# EAGLE design detectino-raspi (EAGLE 7.2.0)
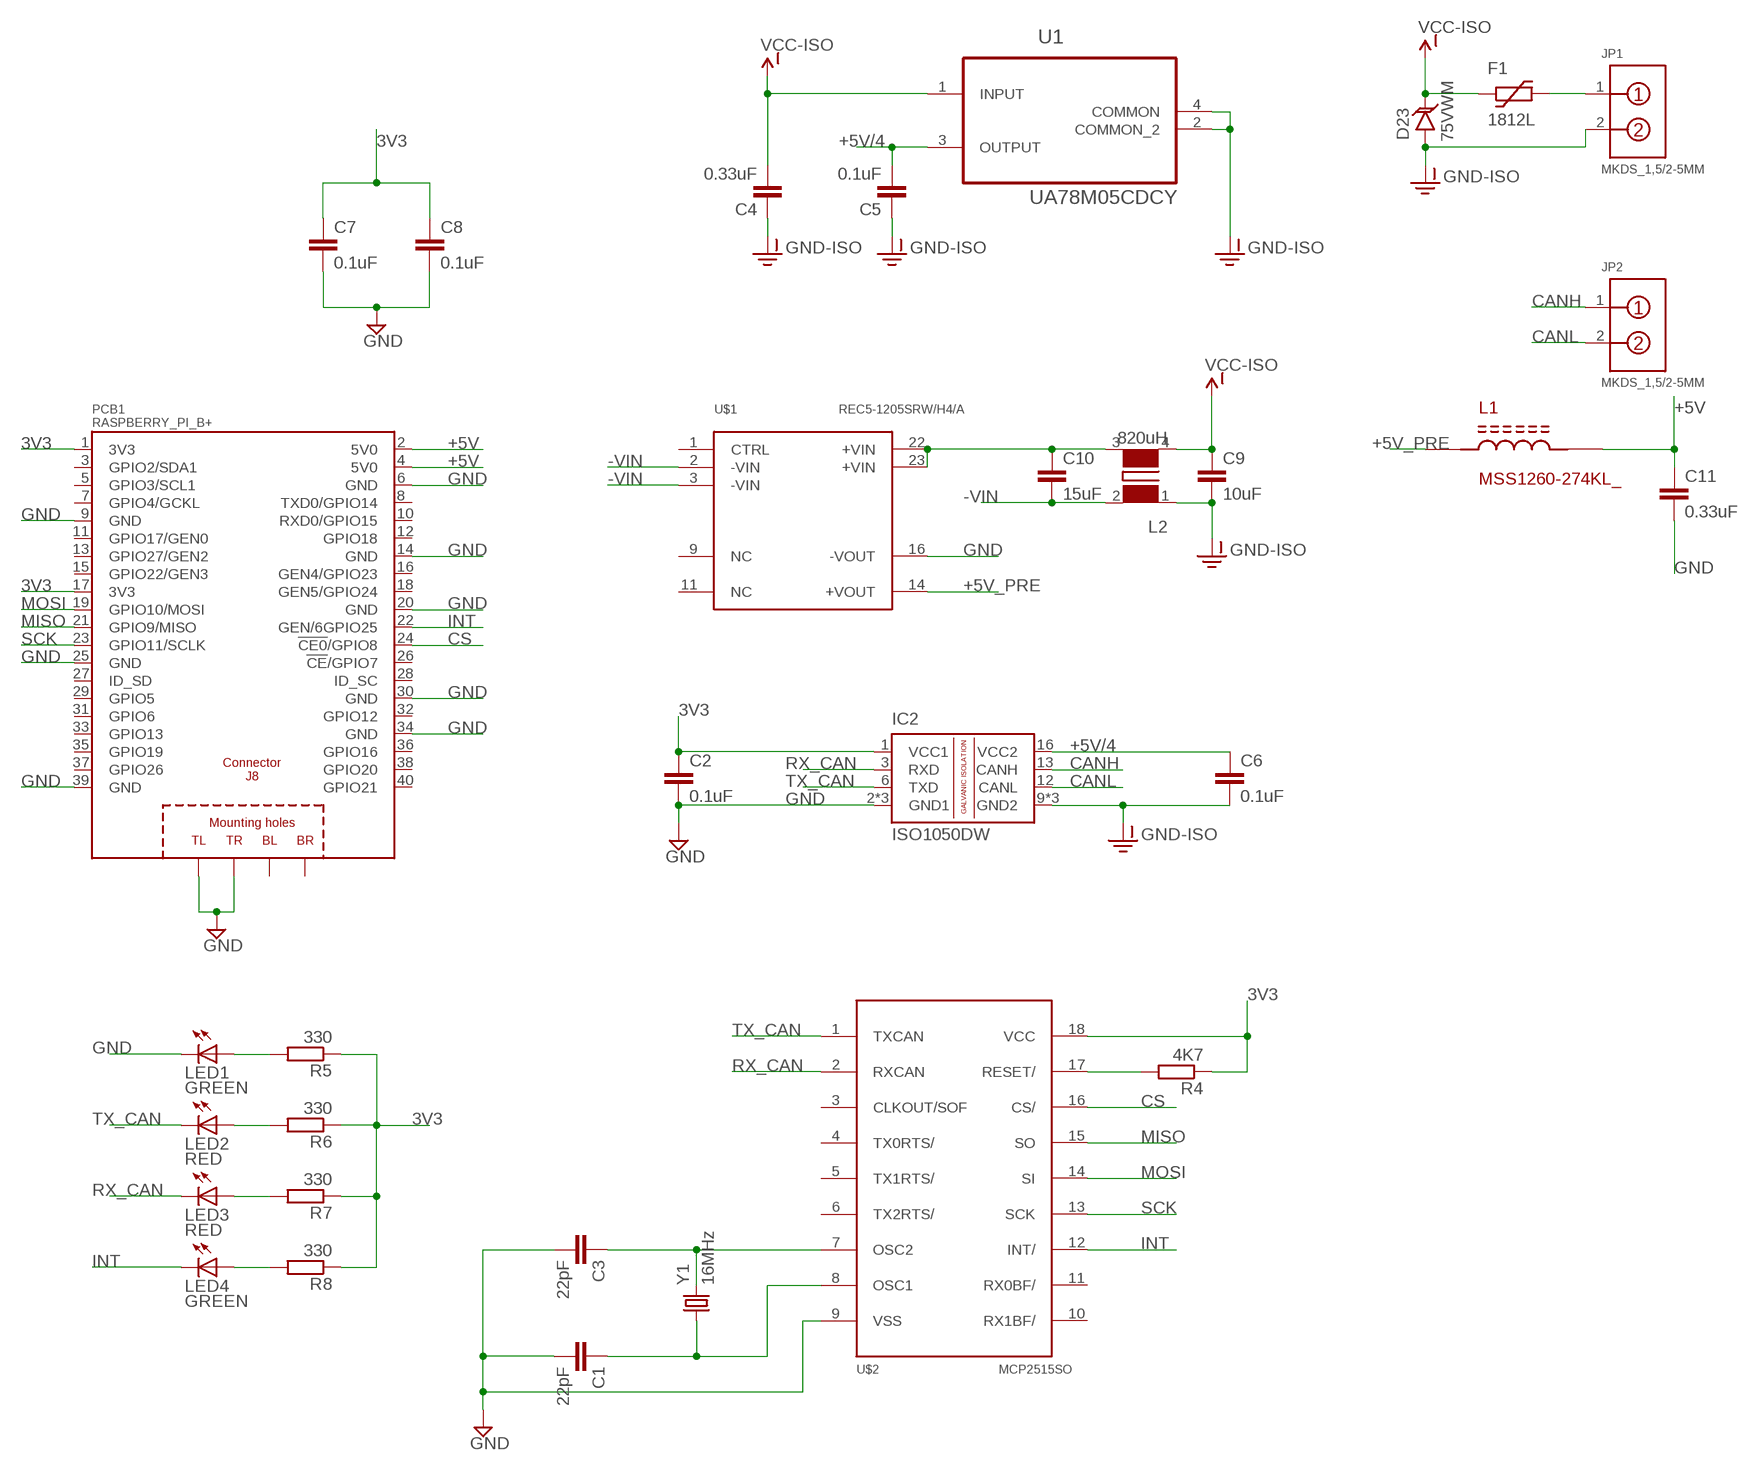
[diagram p0: schematic, sheet 1]

## Parts
C1  22pF  C-EUC1206K  [C1206K]
C2  0.1uF  C-EUC1206K  [C1206K]
C3  22pF  C-EUC1206K  [C1206K]
C4  0.33uF  C-EUC1206K  [C1206K]
C5  0.1uF  C-EUC1206K  [C1206K]
C6  0.1uF  C-EUC1206K  [C1206K]
C7  0.1uF  C-EUC1206K  [C1206K]
C8  0.1uF  C-EUC1206K  [C1206K]
C9  10uF  C-EUC1812K  [C1812K]
C10  15uF  C-EUC1812K  [C1812K]
C11  0.33uF  C-EUC1206K  [C1206K]
D23  75VWM  TVS75VWM  [SMC]
F1  1812L  [1812L]
IC2  ISO1050DW  [SO-16DW]
JP1  MKDS_1,5/2-5MM  [MKDS_1,5/2-5MM]
JP2  MKDS_1,5/2-5MM  [MKDS_1,5/2-5MM]
L1  MSS1260-274KL_  [MSS1260]
L2  820uH  WE-FC-7448640395_ET  [WE-FC_ET]
LED1  GREEN  LEDSML1206  [SML1206]
LED2  RED  LEDSML1206  [SML1206]
LED3  RED  LEDSML1206  [SML1206]
LED4  GREEN  LEDSML1206  [SML1206]
PCB1  RASPBERRY_PI_B+  [RASPBERRY_PI_B+]
R4  4K7  R-EU_R1206  [R1206]
R5  330  R-EU_R1206  [R1206]
R6  330  R-EU_R1206  [R1206]
R7  330  R-EU_R1206  [R1206]
R8  330  R-EU_R1206  [R1206]
U1  UA78M05CDCY  [SOT230P700X180-4N]
U$1  REC5-1205SRW/H4/A  [DIP24]
U$2  MCP2515SO  [SO18L]
Y1  16MHz  CRYSTALHC49US  [HC49US]

## Nets
3V3: C2.1 C7.1 C8.1 IC2.1(VCC1) PCB1.1(3V3) PCB1.17(3V3) R4.1 R5.1 R6.1 R7.1 R8.1 U$2.18(VCC)
+5V [vcc-big]: C11.1 L1.P$2 PCB1.2(5V0) PCB1.4(5V0)
+5V/4: C5.2 C6.1 IC2.16(VCC2) U1.3(OUTPUT)
+5V_PRE [vcc-big]: L1.P$1 U$1.14(+VOUT)
+VIN [vcc]: C10.1 L2.3 U$1.22(+VIN) U$1.23(+VIN)
-VIN [gnd]: C10.2 L2.2 U$1.2(-VIN) U$1.3(-VIN)
CANH: IC2.13(CANH) JP2.1
CANL: IC2.12(CANL) JP2.2
CS [signal]: PCB1.24(!CE0!/GPIO8) U$2.16(CS/)
GND [gnd-big]: C1.2 C2.2 C3.2 C7.2 C8.2 C11.2 IC2.2(GND1) IC2.7(GND1) IC2.8(GND1) LED1.C PCB1.6(GND) PCB1.9(GND) PCB1.14(GND) PCB1.20(GND) PCB1.25(GND) PCB1.30(GND) PCB1.34(GND) PCB1.39(GND) PCB1.PE_TL(TL) PCB1.PE_TR(TR) U$1.16(-VOUT) U$2.9(VSS)
GND-ISO [gnd]: C4.1 C5.1 C6.2 C9.2 D23.A IC2.9(GND2) IC2.10(GND2) IC2.15(GND2) JP1.2 L2.1 U1.2(COMMON_2) U1.4(COMMON)
INT [signal]: LED4.C PCB1.22(GEN/6GPIO25) U$2.12(INT/)
MISO [signal]: PCB1.21(GPIO9/MISO) U$2.15(SO)
MOSI [signal]: PCB1.19(GPIO10/MOSI) U$2.14(SI)
N$2: R4.2 U$2.17(RESET/)
N$3: C1.1 U$2.8(OSC1) Y1.1
N$4: C3.1 U$2.7(OSC2) Y1.2
N$5: F1.P$2 JP1.1
N$6: LED1.A R5.2
N$7: LED2.A R6.2
N$8: LED3.A R7.2
N$9: LED4.A R8.2
RX_CAN [signal]: IC2.3(RXD) LED3.C U$2.2(RXCAN)
SCK [signal]: PCB1.23(GPIO11/SCLK) U$2.13(SCK)
TX_CAN [signal]: IC2.6(TXD) LED2.C U$2.1(TXCAN)
VCC-ISO [vcc]: C4.2 C9.1 D23.C F1.P$1 L2.4 U1.1(INPUT)
Unconnected: PCB1.3(GPIO2/SDA1) PCB1.5(GPIO3/SCL1) PCB1.7(GPIO4/GCKL) PCB1.8(TXD0/GPIO14) PCB1.10(RXD0/GPIO15) PCB1.11(GPIO17/GEN0) PCB1.12(GPIO18) PCB1.13(GPIO27/GEN2) PCB1.15(GPIO22/GEN3) PCB1.16(GEN4/GPIO23) PCB1.18(GEN5/GPIO24) PCB1.26(!CE!/GPIO7) PCB1.27(ID_SD) PCB1.28(ID_SC) PCB1.29(GPIO5) PCB1.31(GPIO6) PCB1.32(GPIO12) PCB1.33(GPIO13) PCB1.35(GPIO19) PCB1.36(GPIO16) PCB1.37(GPIO26) PCB1.38(GPIO20) PCB1.40(GPIO21) PCB1.PE_BL(BL) PCB1.PE_BR(BR) U$1.1(CTRL) U$1.9(NC) U$1.11(NC) U$2.3(CLKOUT/SOF) U$2.4(TX0RTS/) U$2.5(TX1RTS/) U$2.6(TX2RTS/) U$2.10(RX1BF/) U$2.11(RX0BF/)

## Library data of the parts
C1-C11 = rcl:C-EU: CAPACITOR, European symbol
D23 = SparkFun-DiscreteSemi:TVS: Transient voltage suppressor- prevents ESD on inputs.; PROD_ID: DIO-12443
F1 = ptc-littlefuse:1812L
IC2 = texas:ISO1050: ISOLATED CAN TRANSCEIVER Source: http://focus.ti.com/lit/ds/symlink/iso1050.pdf
JP1 JP2 = con-phonenix-mkds:MKDS_1,5/2-5MM
L1 = matteo:MSS1260: CoilCraft MSS1260 series. http://www.farnell.com/datasheets/1681951.pdf
L2 = WE-FC:WE-FC: Current Compensated Power Line Choke WE-FC - Closed rectangular ferrit core - 2-section winding for excellent high frequency performance - 1% stray inductance for symmetrical interference suppression - Recyclable due to no encapsulation - Rated voltage 250 VAC - Isolation voltage 2000 VAC -- Switch mode power supplies -- Electronic ballasts for lamps; MPN: 7448640395; OC_FARNELL: 1636311; OC_NEWARK: 08P2923; PACKAGE: ET20V; SUPPLIER: Wuerth Elektronik
LED1-LED4 = led:LED: LED OSRAM: - CHIPLED LG R971, LG N971, LY N971, LG Q971, LY Q971, LO R971, LY R971 LH N974, LH R974 LS Q976, LO Q976, LY Q976 LO Q996 - Hyper CHIPLED LW Q18S LB Q993, LB Q99A, LB R99A - SideLED LS A670, LO A670, LY A670, LG A670, LP A670 LB A673, LV A673, LT A673, LW A673 LH A674 LY A675 LS A676, LA A676, LO A676, LY A676, LW A676 LS A679, LY A679, LG A679 - Hyper Micro SIDELED® LS Y876, LA Y876, LO Y876, LY Y876 LT Y87S - SmartLED LW L88C, LW L88S LB L89C, LB L89S, LG L890 LS L89K, LO L89K, LY L89K LS L896, LA L896, LO L896, LY L896 - TOPLED LS T670, LO T670, LY T670, LG T670, LP T670 LSG T670, LSP T670, LSY T670, LOP T670, LYG T670 LG T671, LOG T671, LSG T671 LB T673, LV T673, LT T673, LW T673 LH T674 LS T676, LA T676, LO T676, LY T676, LB T676, LH T676, LSB T676, LW T676 LB T67C, LV T67C, LT T67C, LS T67K, LO T67K, LY T67K, LW E67C LS E67B, LA E67B, LO E67B, LY E67B, LB E67C, LV E67C, LT E67C LW T67C LS T679, LY T679, LG T679 LS T770, LO T770, LY T770, LG T770, LP T770 LB T773, LV T773, LT T773, LW T773 LH T774 LS E675, LA E675, LY E675, LS T675 LS T776, LA T776, LO T776, LY T776, LB T776 LHGB T686 LT T68C, LB T68C - Hyper Mini TOPLED® LB M676 - Mini TOPLED Santana® LG M470 LS M47K, LO M47K, LY M47K Source: http://www.osram.convergy.de LUXEON: - LUMILED® LXK2-PW12-R00, LXK2-PW12-S00, LXK2-PW14-U00, LXK2-PW14-V00 LXK2-PM12-R00, LXK2-PM12-S00, LXK2-PM14-U00 LXK2-PE12-Q00, LXK2-PE12-R00, LXK2-PE12-S00, LXK2-PE14-T00, LXK2-PE14-U00 LXK2-PB12-K00, LXK2-PB12-L00, LXK2-PB12-M00, LXK2-PB14-N00, LXK2-PB14-P00, LXK2-PB14-Q00 LXK2-PR12-L00, LXK2-PR12-M00, LXK2-PR14-Q00, LXK2-PR14-R00 LXK2-PD12-Q00, LXK2-PD12-R00, LXK2-PD12-S00 LXK2-PH12-R00, LXK2-PH12-S00 LXK2-PL12-P00, LXK2-PL12-Q00, LXK2-PL12-R00 Source: www.luxeon.com KINGBRIGHT: KA-3528ASYC Source: www.kingbright.com
PCB1 = RASPBERRY_PI_Bplus_no_silk:RASPBERRY_PI_B+: Raspberry Pi B+ Based on issue: Thursday, July 10, 2014 - Rev 1.2 LBR by Tim R. 07-2014
R4-R8 = rcl:R-EU_: RESISTOR, European symbol
U1 = Texas Instruments_By_element14_Batch_1:UA78M05CDCY: IC, LINEAR VOLT REGULATOR, 5V; MPN: UA78M05CDCY; OC_FARNELL: 1575761; OC_NEWARK: 77C1885; PACKAGE: SOT-223-3; SUPPLIER: TEXAS INSTRUMENTS
U$1 = matteo:REC5
U$2 = MCP2515_MT:MCP2515*: MCP2515 Standalone CAN-Controller by Microchip Eagle-Lib. by MartinThomas
Y1 = SparkFun-FreqCtrl:CRYSTAL: Various standard crystals. Proven footprints.

## Net classes
0 default: width 0.406 mm, clearance 0.203 mm
1 gnd: width 0.508 mm, clearance 0.203 mm
2 vcc: width 0.508 mm, clearance 0.203 mm
3 vcc-big: width 0.508 mm, clearance 0.203 mm
4 gnd-big: width 0.508 mm, clearance 0.203 mm
5 signal: width 0.254 mm, clearance 0.203 mm

## Board
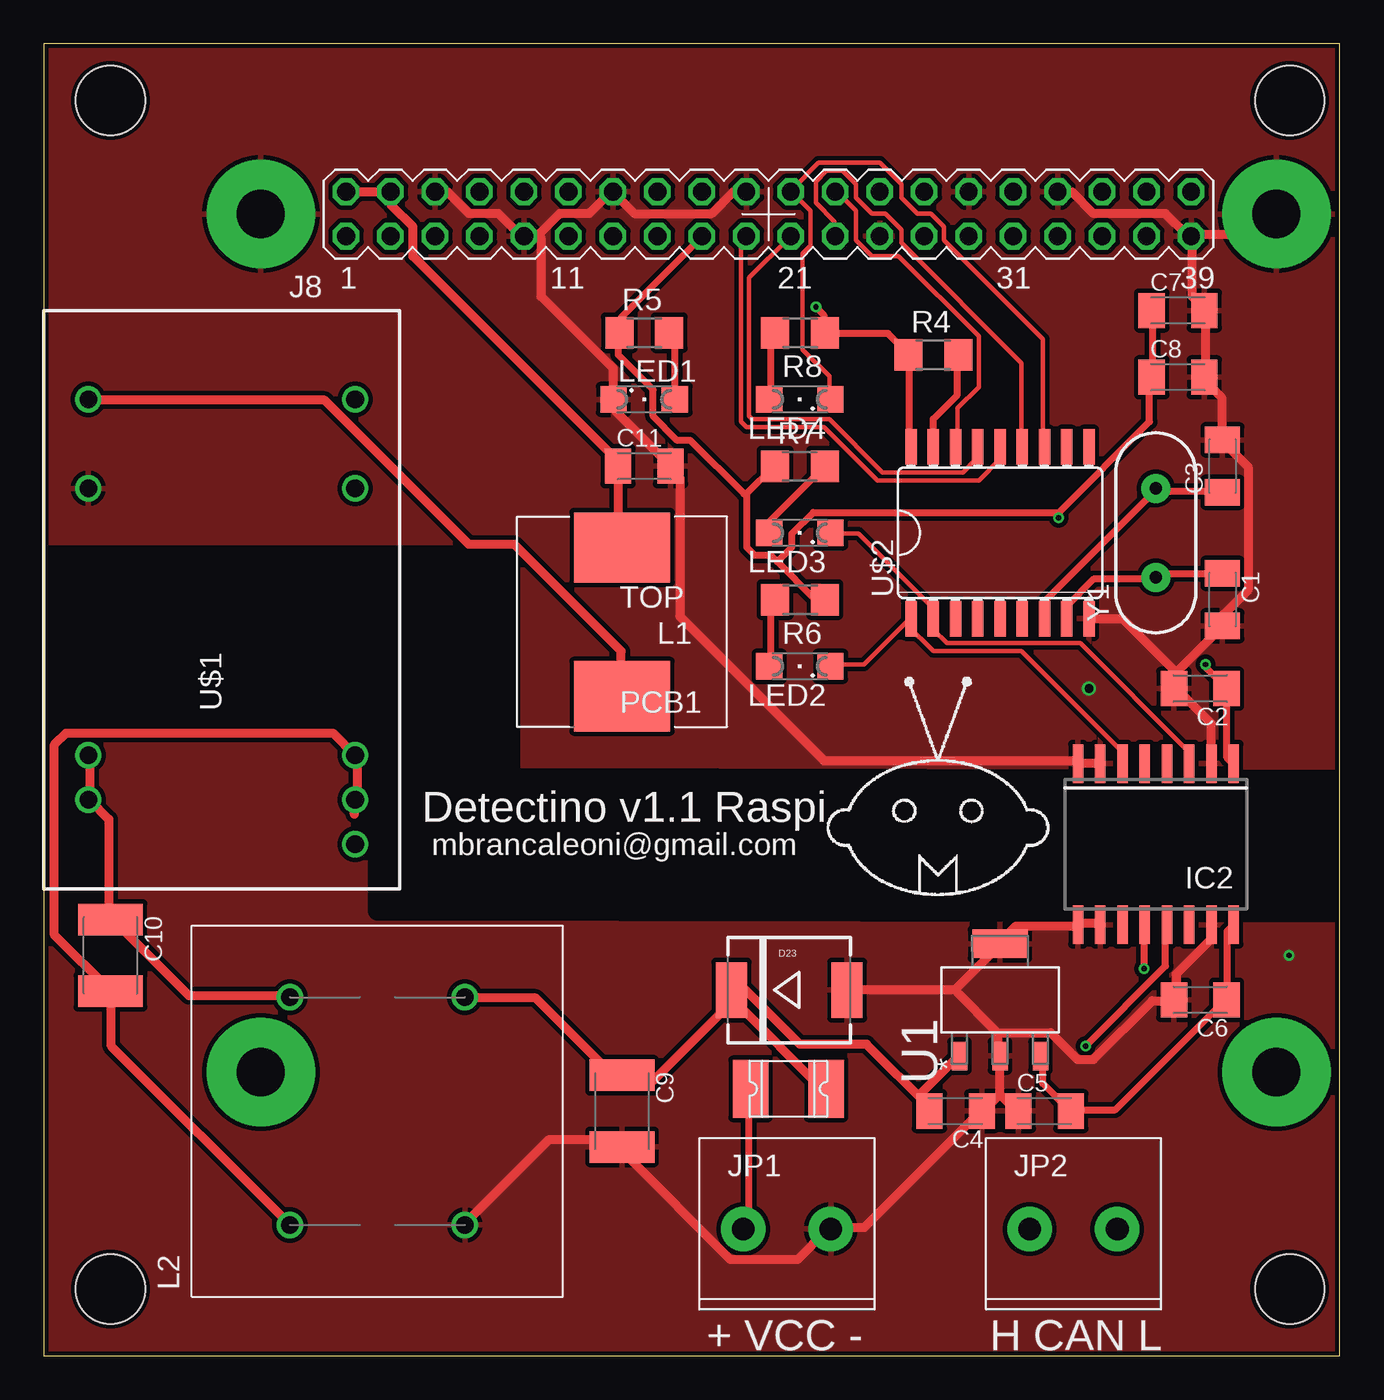
[diagram p1: board, top side]
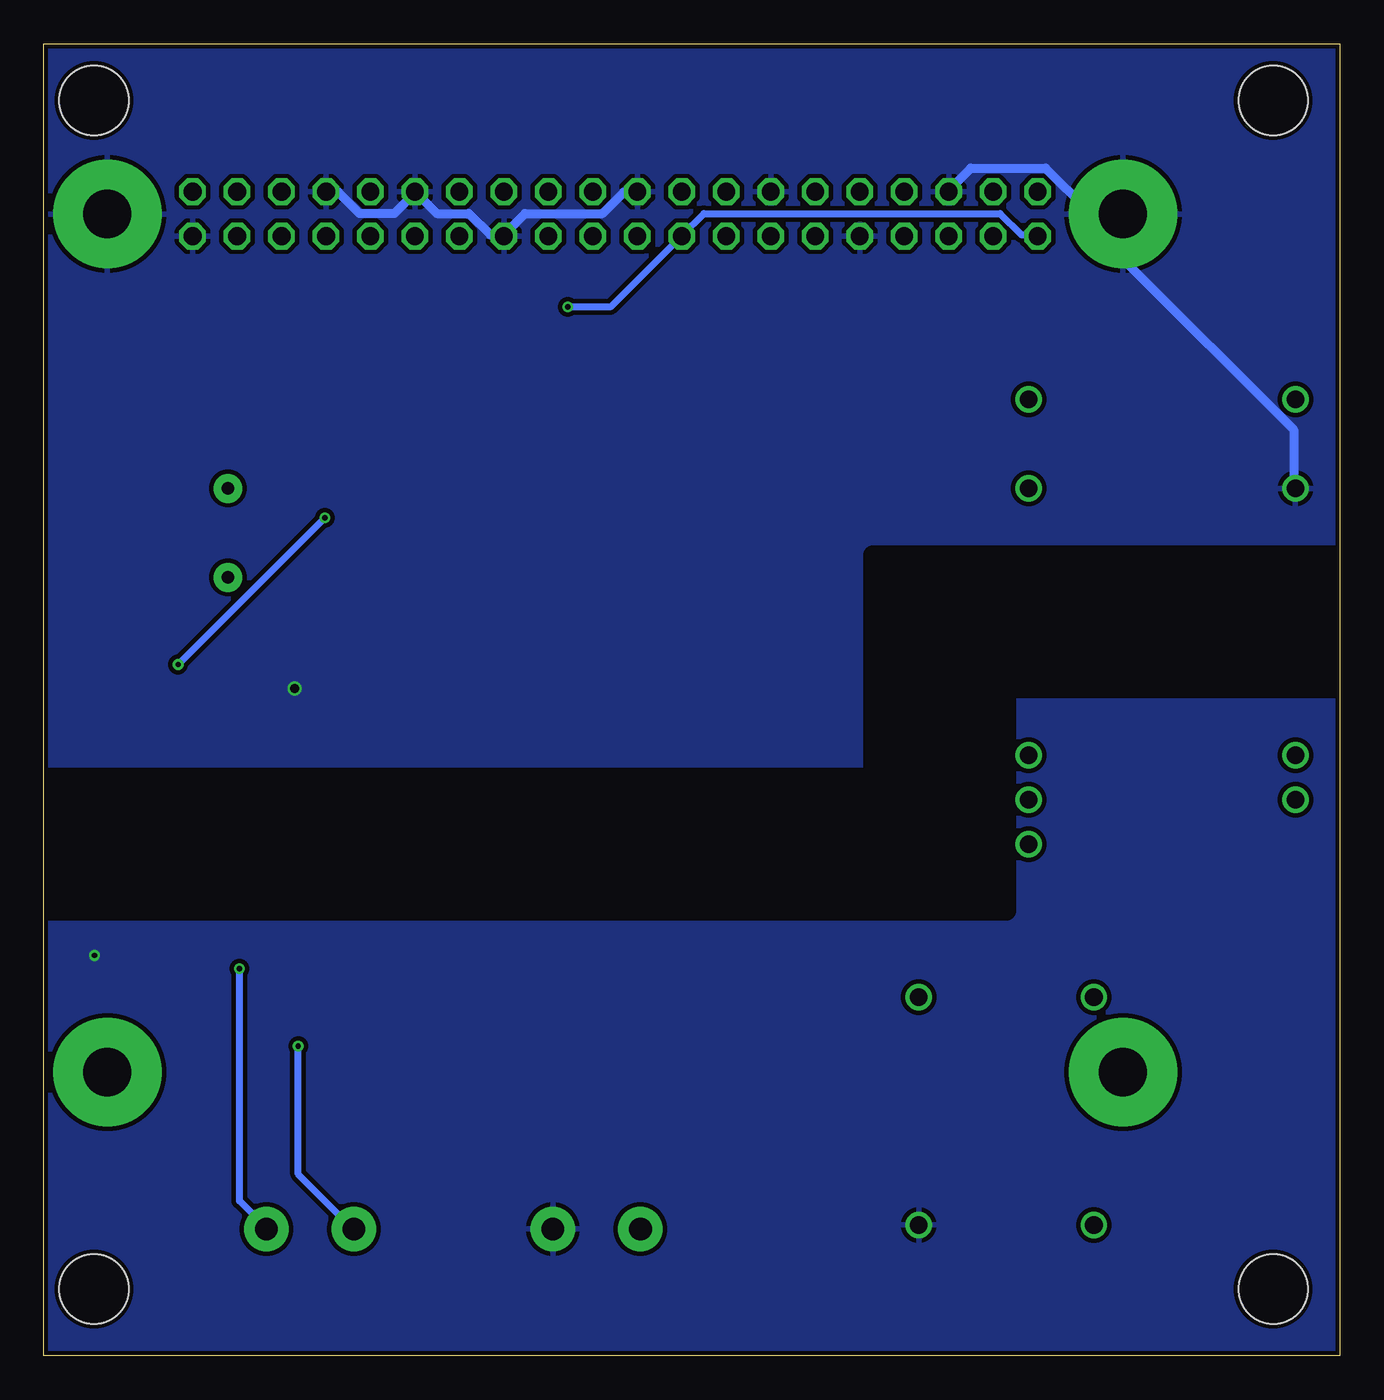
[diagram p2: board, bottom side, seen from below]

Size 74.02 x 74.92 mm. Coordinates in mm from the lower left corner, seen from the top.
Outline: 0,0 74.02,0 74.02,74.92 0,74.92 0,0
Copper layers (1*16): Top 0.035mm / dielectric 1.5mm / Bottom 0.035mm
Design rules "SeeedStudio_2layer_DRU_no_angle_20140221": minimum track width 6mil, minimum drill 12mil, track to track 6mil, track to pad 6mil, pad to pad 6mil, via to via 6mil, smd to smd 0mil, copper to edge 10mil, drill to drill 10mil, minimum pad ring 10mil, minimum via ring 6mil, stop-mask expansion 2mil, vias tented up to drill 100mil, thermal gap 10mil
Holes 3.96 mm at 3.81,71.68 71.15,71.68 3.81,3.81 71.15,3.81
tRestrict: area 0,25.3 to 74.2,45.7
bRestrict: area 0,25.4 to 74.2,45.7

### Footprints (pad centres in the part's own frame; a part is rotated, then mirrored left to right if it is on the bottom)
C1206K = smd 1.5 x 2: 1 -1.5,0; 2 1.5,0
C1812K = smd 1.8 x 3.7: 1 -2.05,0; 2 2.05,0
SMC = smd 1.778 x 3.175: A 3.302,0; C -3.302,0
1812L = smd 2.03 x 3.3: P$1 -2.16,0; P$2 2.16,0
SO-16DW = smd 0.6 x 2.2: 1 -4.445,-4.6; 2 -3.175,-4.6; 3 -1.905,-4.6; 4 -0.635,-4.6; 5 0.635,-4.6; 6 1.905,-4.6; 7 3.175,-4.6; 8 4.445,-4.6; 9 4.445,4.6; 10 3.175,4.6; 11 1.905,4.6; 12 0.635,4.6; 13 -0.635,4.6; 14 -1.905,4.6; 15 -3.175,4.6; 16 -4.445,4.6
MKDS_1,5/2-5MM = drill 1.3 pad 2.54: 1 -2.5,0; 2 2.5,0
MSS1260 = smd 5.5 x 4: P$1 0,4.25; P$2 0,-4.25
WE-FC_ET = drill 1: 1 -6.5,-5; 2 -6.5,5; 3 6.5,5; 4 6.5,-5
SML1206 = smd 1.5 x 1.5: A 1.75,0; C -1.75,0
RASPBERRY_PI_B+ = drill 1.016 octagon: 1 8.37,51.23; 2 8.37,53.77; 3 10.91,51.23; 4 10.91,53.77; 5 13.45,51.23; 6 13.45,53.77; 7 15.99,51.23; 8 15.99,53.77; 9 18.53,51.23; 10 18.53,53.77; 11 21.07,51.23; 12 21.07,53.77; 13 23.61,51.23; 14 23.61,53.77; 15 26.15,51.23; 16 26.15,53.77; 17 28.69,51.23; 18 28.69,53.77; 19 31.23,51.23; 20 31.23,53.77; 21 33.77,51.23; 22 33.77,53.77; 23 36.31,51.23; 24 36.31,53.77; 25 38.85,51.23; 26 38.85,53.77; 27 41.39,51.23; 28 41.39,53.77; 29 43.93,51.23; 30 43.93,53.77; 31 46.47,51.23; 32 46.47,53.77; 33 49.01,51.23; 34 49.01,53.77; 35 51.55,51.23; 36 51.55,53.77; 37 54.09,51.23; 38 54.09,53.77; 39 56.63,51.23; 40 56.63,53.77 | drill 2.75 pad 6.2: PE_BL 3.5,3.5; PE_BR 61.5,3.5; PE_TL 3.5,52.5; PE_TR 61.5,52.5
R1206 = smd 1.6 x 1.803: 1 -1.422,0; 2 1.422,0
SOT230P700X180-4N = smd 1.626 x 0.889: 1 -3.2,2.311; 2 -3.2,0; 3 -3.2,-2.311 | smd 1.626 x 3.175: 4 3.2,0
DIP24 = drill 1: 1 -12.7,-7.62; 2 -10.16,-7.62; 3 -7.62,-7.62; 9 7.62,-7.62; 11 12.7,-7.62; 14 12.7,7.62; 16 7.62,7.62; 22 -7.62,7.62; 23 -10.16,7.62
SO18L = smd 0.66 x 2.032: 1 -5.08,-4.902; 2 -3.81,-4.902; 3 -2.54,-4.902; 4 -1.27,-4.902; 5 0,-4.902; 6 1.27,-4.902; 7 2.54,-4.902; 8 3.81,-4.902; 9 5.08,-4.902; 10 5.08,4.902; 11 3.81,4.902; 12 2.54,4.902; 13 1.27,4.902; 14 0,4.902; 15 -1.27,4.902; 16 -2.54,4.902; 17 -3.81,4.902; 18 -5.08,4.902
HC49US = drill 0.7 pad 1.651: 1 -2.54,0; 2 2.54,0

### Placement (x,y rotation side)
C1  67.31,43.18 270 top
C2  66.04,38.1 180 top
C3  67.31,50.8 90 top
C4  52.07,13.97 180 top
C5  57.15,13.97 0 top
C6  66.04,20.32 180 top
C7  64.77,59.69 0 top
C8  64.77,55.88 0 top
C9  33.02,13.97 270 top
C10  3.81,22.86 270 top
C11  34.29,50.8 0 top
D23  42.57,20.88 0 top
F1  42.52,15.24 180 top
IC2  63.5,29.21 180 top
JP1  42.44,7.24 0 top
JP2  58.8,7.24 0 top
L1  33.02,41.91 180 top
L2  19.05,13.97 90 top
LED1  34.29,54.61 0 top
LED2  43.18,39.37 180 top
LED3  43.18,46.99 180 top
LED4  43.18,54.61 180 top
PCB1  8.89,12.7 0 top
R4  50.8,57.15 0 top
R5  34.29,58.42 0 top
R6  43.18,43.18 180 top
R7  43.18,50.8 0 top
R8  43.18,58.42 180 top
U1  54.61,20.32 90 top
U$1  10.16,41.91 90 top
U$2  54.61,46.99 0 top
U$6  [LOGO]  51.05,30.07 0 top
Y1  63.5,46.99 90 top

### Tracks (layer width: path | path; a pad name or v marks a point on that pad's centre or on a via)
3V3  (via drill 0.3)
  Top 0.406: U$2.18 49.43,51.97 49.43,57.15 R4.1 49.28,57.3 48.21,58.37 44.7,58.37 R8.1 44.55,58.52 44.55,59.44 v44.09,59.89 | PCB1.17 37.54,63.86 32.97,59.28 32.97,58.52 R5.1 32.82,58.22 32.82,57.15 34.8,55.17 34.8,53.65 36.17,52.27 36.93,52.27 39.98,49.23 40.13,49.23 | IC2.1 67.87,33.83 67.56,34.14 67.56,38.1 C2.1 67.41,38.25 66.34,39.32 v66.34,39.47 | C7.1 63.3,59.59 63.3,55.93 C8.1 63.14,55.78 63.14,53.34 57.96,48.16 | 41.89,45.34 41.5,45.72 40.59,45.72 40.13,46.18 40.13,49.23 | 41.89,45.34 43.94,43.28 44.55,43.28 R6.1 | 40.13,49.23 41.66,50.75 R7.1 | 57.96,48.16 43.94,48.16 42.72,46.94 42.72,46.18 41.89,45.34 | v57.96,47.85 57.96,48.16
  Bottom 0.406: PCB1.1 17.27,64.01 18.19,64.01 19.41,65.23 36.32,65.23 37.54,64.01 PCB1.17 37.69,63.86 41.66,59.89 v44.09,59.89 | v57.96,47.85 v66.34,39.47
+5V
  Top 0.508: PCB1.2 17.27,66.45 19.71,66.45 PCB1.4 19.86,66.29 19.86,65.68 21.08,64.47 21.08,62.79 32.82,51.05 C11.1 32.82,50.75 32.82,46.33 32.97,46.18 L1.P$2
+5V/4
  Top 0.406: U1.3 57.05,17.07 57.05,15.55 58.57,14.02 C5.2 58.73,14.02 61.16,14.02 67.41,20.27 C6.1 67.56,20.42 67.56,24.23 67.87,24.54 IC2.16
+5V_PRE
  Top 0.508: U$1.14 2.64,54.56 16.05,54.56 24.28,46.33 26.87,46.33 32.97,40.23 32.97,37.8 L1.P$1
+VIN
  Top 0.508: U$1.22 2.64,34.29 2.64,31.85 U$1.23 2.64,31.7 3.71,30.63 3.71,24.99 C10.1 4.01,24.84 8.28,20.57 13.92,20.57 L2.3
-VIN
  Top 0.508: L2.2 13.92,7.62 3.86,17.68 3.86,20.73 C10.2 3.81,20.83 0.61,24.03 0.61,34.9 1.27,35.56 16.51,35.56 U$1.3 17.88,34.29 17.88,31.85 U$1.2 17.73,31.55 17.73,30.94
CANH  (via drill 0.3)
  Top 0.406: v59.49,17.68 64.06,22.25 64.06,24.54 IC2.13
  Bottom 0.406: v59.49,17.68 59.49,10.36 56.44,7.32 JP2.1
CANL  (via drill 0.3)
  Top 0.406: v62.84,22.1 62.84,24.54 IC2.12
  Bottom 0.406: v62.84,22.1 62.84,8.84 61.32,7.32 JP2.2
CS
  Top 0.254: U$2.16 52.17,51.97 52.17,54.1 53.39,55.32 53.39,58.22 48.82,62.79 47.3,62.79 46.38,63.7 46.38,65.38 45.31,66.45 PCB1.24
GND  (via drill 0.5 pad 0.25)
  Top 0.508: IC2.7 60.25,33.83 59.18,33.83 IC2.8 58.88,33.98 44.55,33.98 36.32,42.22 36.32,50.14 35.86,50.6 C11.2 35.71,50.9 32.66,53.95 32.66,54.56 LED1.C 32.51,54.86 32.51,56.39 28.4,60.5 28.4,63.86 28.25,64.01 | 28.25,64.01 27.48,64.01 PCB1.9 27.18,64.01 25.96,65.23 24.28,65.23 23.06,66.45 22.45,66.45 PCB1.6 | 28.25,64.01 29.46,65.23 31.14,65.23 32.36,66.45 PCB1.14 32.66,66.29 33.73,65.23 38.15,65.23 39.37,66.45 39.98,66.45 PCB1.20 | 64.67,39.01 64.67,38.1 C2.2 64.82,37.95 66.65,36.12 66.65,33.83 IC2.2 | 64.67,39.01 67.26,41.6 C1.2 67.41,41.91 67.41,42.37 68.78,43.74 68.78,50.75 67.41,52.12 C3.2 67.26,52.43 67.26,54.71 66.34,55.63 C8.2 66.34,55.93 66.34,59.59 C7.2 66.19,59.89 65.58,60.5 65.58,63.86 PCB1.39 | 64.67,39.01 61.62,42.06 59.79,42.06 U$2.9 | PCB1.39 65.73,64.01 69.24,64.01 70.31,65.07 PCB1.PE_TR | PCB1.34 57.96,66.45 58.73,66.45 59.94,65.23 64.06,65.23 65.28,64.01 PCB1.39
  Bottom 0.508: U$1.16 2.64,49.53 2.64,52.88 12.24,62.48 12.24,65.07 PCB1.PE_TL 12.55,65.38 14.38,65.38 16.82,67.82 21.08,67.82 22.3,66.6 PCB1.6 | PCB1.34 57.81,66.45 57.2,66.45 55.98,65.23 54,65.23 52.93,66.29 PCB1.30 52.78,66.45 51.56,65.23 49.73,65.23 48.51,64.01 47.75,64.01 PCB1.25 47.6,64.16 46.53,65.23 42.11,65.23 40.89,66.45 40.13,66.45 PCB1.20
  other vias: 59.69,38.1
  pour Bottom (isolate 0.254): 0,74.93 74.93,74.93 74.93,33.02 26.67,33.02 26.67,45.72 0,45.72
  pour Top (isolate 0.254): 0,74.93 74.93,74.93 74.93,33.02 26.67,33.02 26.67,45.72 0,45.72
GND-ISO  (via drill 0.3 pad 0.25)
  Top 0.508: L2.1 24.13,7.62 28.85,12.34 32.97,12.34 C9.2 33.12,12.19 33.12,11.58 39.22,5.49 43.03,5.49 44.7,7.16 JP1.2 45.01,7.32 46.84,7.32 53.39,13.87 C4.1 53.7,14.02 54.61,14.93 | IC2.15 66.65,24.54 66.65,23.77 64.67,21.79 64.67,20.42 C6.2 64.36,20.27 63.3,20.27 59.94,16.92 59.03,16.92 57.51,18.44 54.46,18.44 | 54.61,14.93 U1.2 54.46,17.22 54.46,18.44 | 54.61,14.93 55.52,14.02 C5.1 | IC2.10 60.25,24.69 59.18,24.69 IC2.9 58.88,24.54 55.52,24.54 54.61,23.62 U1.4 54.46,23.32 52.02,20.88 | 52.02,20.88 D23.A | 52.02,20.88 54.46,18.44
  other vias: 71.12,22.86
  pour Bottom (isolate 0.254): 0,38.1 0,0 73.66,0 74.93,0 74.93,25.4 19.05,25.4 19.05,38.1
  pour Top (isolate 0.254): 0,38.1 0,0 73.66,0 74.93,0 74.93,25.4 19.05,25.4 19.05,38.1
INT
  Top 0.254: LED4.C 44.86,54.71 44.86,55.93 43.33,57.46 43.33,62.94 43.79,63.4 43.79,65.38 42.72,66.45 PCB1.22 42.72,66.6 44.25,68.12 47.75,68.12 48.97,66.9 48.97,66.14 49.89,65.23 50.65,65.23 51.41,64.47 51.41,63.7 57.05,58.06 57.05,51.97 U$2.12
MISO
  Top 0.254: U$2.15 53.24,51.82 53.24,51.21 52.48,50.44 47.9,50.44 44.86,53.49 40.44,53.49 40.28,53.65 40.28,61.57 42.57,63.86 PCB1.21
MOSI
  Top 0.254: U$2.14 54.61,51.21 53.39,49.99 47.6,49.99 44.55,53.04 40.13,53.04 39.83,53.34 39.83,63.7 39.98,63.86 PCB1.19
N$2
  Top 0.406: U$2.17 50.8,53.49 52.17,54.86 52.17,57.15 R4.2
N$3
  Top 0.406: C1.1 67.26,44.65 63.75,44.65 63.6,44.5 Y1.1 63.45,44.35 59.94,44.35 58.42,42.82 U$2.8
N$4
  Top 0.406: C3.1 67.26,49.38 63.75,49.38 63.6,49.53 Y1.2 63.45,49.38 57.2,43.13 57.2,42.22 U$2.7
N$5
  Top 0.406: F1.P$2 40.28,15.24 40.28,7.62 39.98,7.32 JP1.1
N$6
  Top 0.406: LED1.A 36.02,54.71 36.02,58.06 35.71,58.37 R5.2
N$7
  Top 0.406: LED2.A 41.5,39.47 41.5,42.98 41.66,43.13 R6.2
N$8
  Top 0.406: LED3.A 41.5,47.09 41.5,47.7 44.55,50.75 R7.2
N$9
  Top 0.406: LED4.A 41.5,54.71 41.5,58.22 41.66,58.37 R8.2
RX_CAN
  Top 0.254: LED3.C 45.01,46.94 46.53,46.94 50.8,42.67 U$2.2 50.8,41.45 51.56,40.69 59.18,40.69 65.28,34.59 65.28,33.83 IC2.3
SCK
  Top 0.254: U$2.13 55.83,51.97 55.83,56.69 48.97,63.55 48.97,64.31 48.06,65.23 47.3,65.23 46.38,66.14 46.38,66.9 45.62,67.67 44.7,67.67 44.09,67.06 44.09,65.84 45.16,64.77 45.16,64.01 PCB1.23
TX_CAN
  Top 0.254: LED2.C 45.01,39.47 46.84,39.47 49.43,42.06 U$2.1 49.28,41.76 50.8,40.23 55.83,40.23 61.47,34.59 61.47,33.83 IC2.6
VCC-ISO
  Top 0.508: 39.8,21.16 43.18,17.78 46.99,17.78 50.57,14.2 C4.2 50.04,14.93 52.17,17.07 U1.1 | 39.8,21.16 39.37,21.59 | F1.P$1 44.45,15.24 39.55,20.14 | 39.55,20.14 39.37,20.32 | D23.C 39.22,20.12 34.8,15.7 33.12,15.7 C9.1 32.82,15.7 28.09,20.42 24.13,20.42 L2.4 | 39.8,21.16 39.52,20.88 D23.C | 39.55,20.14 39.37,19.96 D23.C

### Text on the board
tPlace: Detectino v1.1 Raspi | mbrancaleoni@gmail.com | + VCC - | H CAN L